# EAGLE design working (EAGLE 6.4)
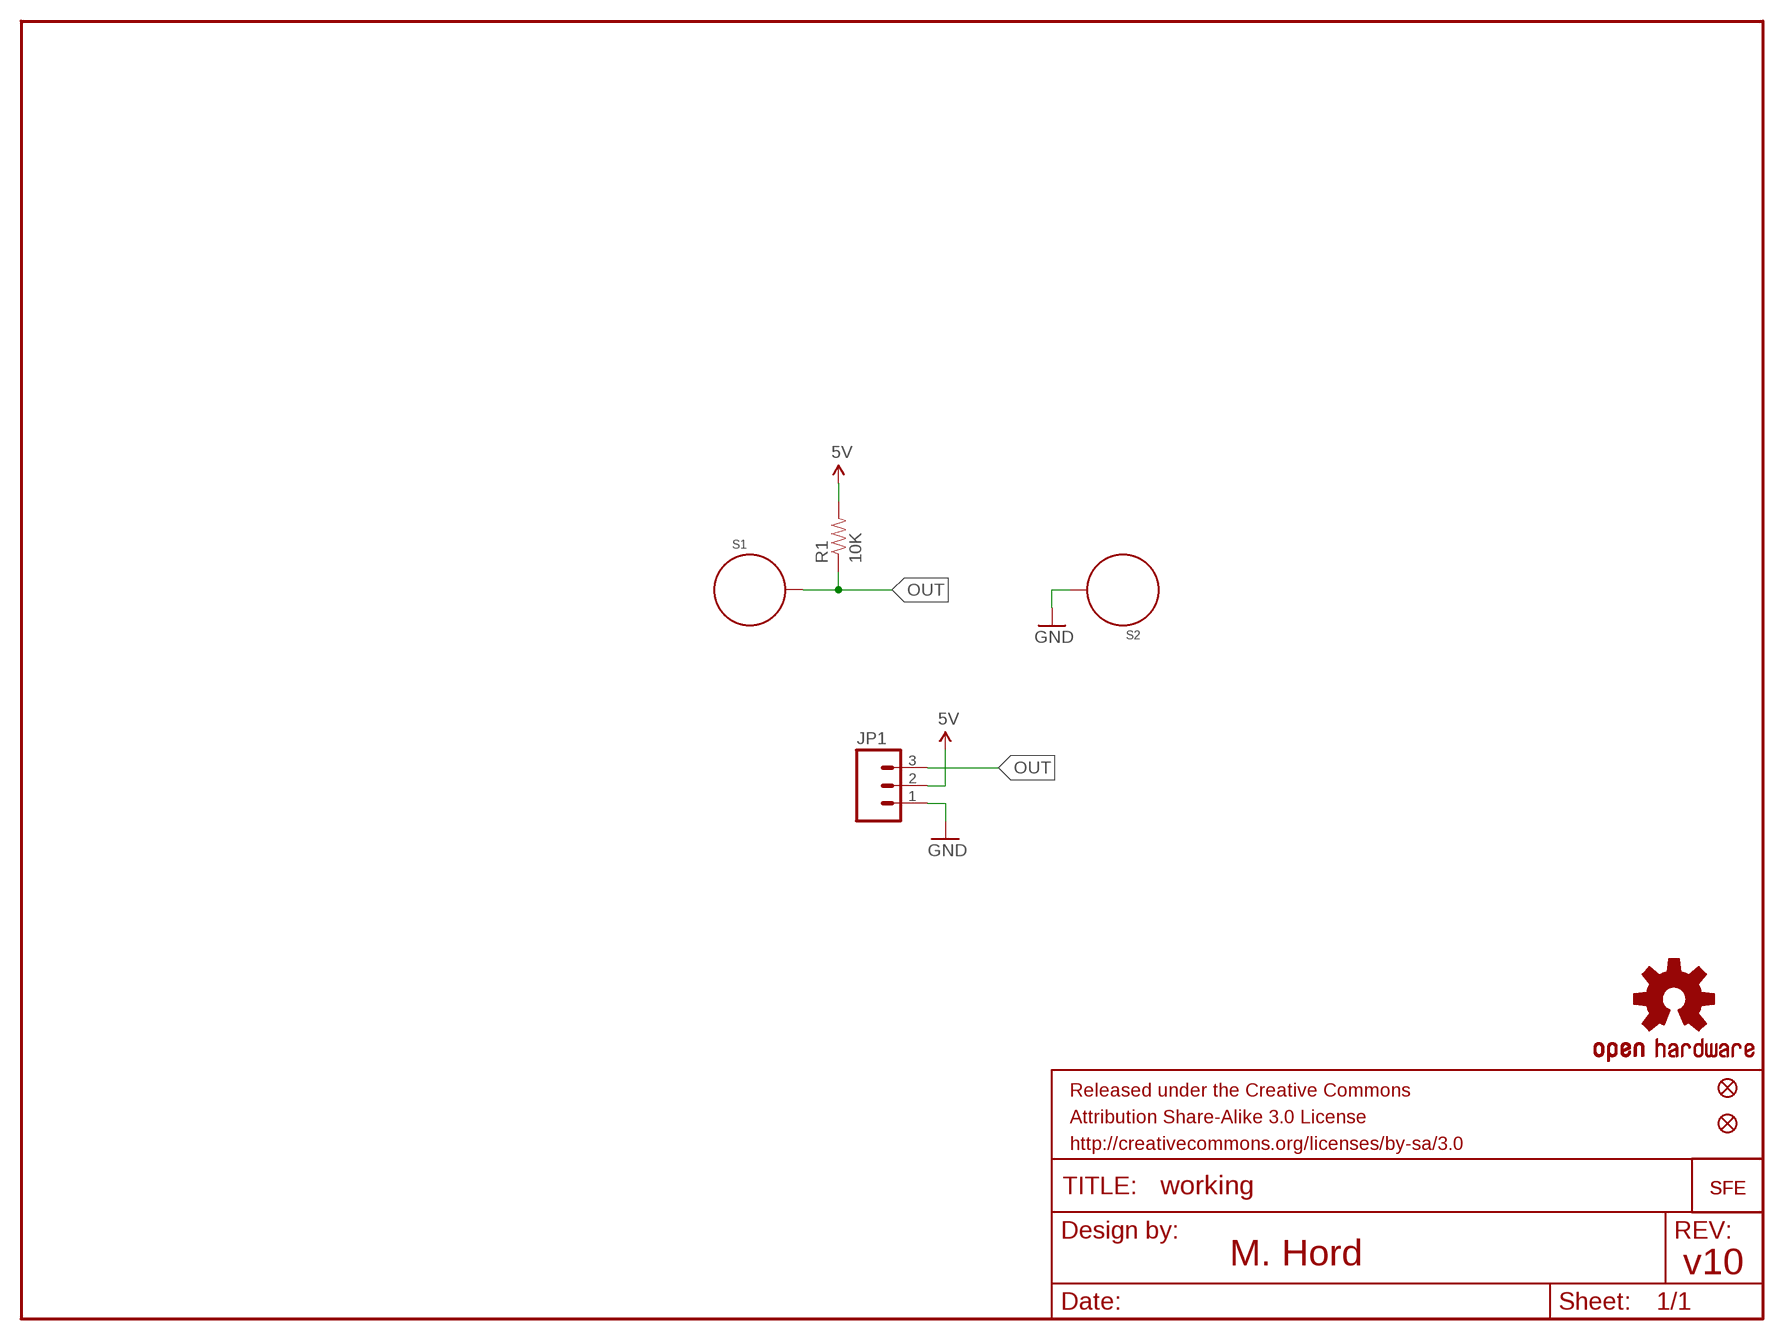
[diagram p0: schematic, sheet 1]

## Parts
FID1  FIDUCIALUFIDUCIAL  [MICRO-FIDUCIAL]
FID2  FIDUCIALUFIDUCIAL  [MICRO-FIDUCIAL]
FRAME1  FRAME-LETTER  [CREATIVE_COMMONS]
JP1  M03SMD_RA_MALE  [1X03_SMD_RA_MALE]
LOGO1  OSHW-LOGOS  [OSHW-LOGO-S]
LOGO2  LOGO-SFESK  [SFE-LOGO-FLAME]
LOGO3  OSHW-LOGOS  [OSHW-LOGO-S]
LOGO4  LOGO-SFESK  [SFE-LOGO-FLAME]
R1  10K  10KOHM1/10W1%(0603)0603  [0603-RES]
S1  STANDOFF_ELECTRICAL  [STANDOFF-ELECTRICAL]
S2  STANDOFF_ELECTRICAL  [STANDOFF-ELECTRICAL]

## Nets
5V: JP1.2 R1.2
GND: JP1.1 S2.P1
OUT: JP1.3 R1.1 S1.P1

## Notes on the sheet
- M. Hord | v10

## Library data of the parts
FID1 FID2 = SparkFun-Aesthetics:FIDUCIAL: Fiducial Alignment Points Various fiducial points for machine vision alignment.
FRAME1 = SparkFun-Aesthetics:FRAME-LETTER: Schematic Frame Standard 8.5x11 US Letter frame
JP1 = SparkFun-Connectors:M03: Header 3 Standard 3-pin 0.1" header. Use with straight break away headers (SKU : PRT-00116), right angle break away headers (PRT-00553), swiss pins (PRT-00743), machine pins (PRT-00117), and female headers (PRT-00115). Molex polarized connector foot print use with SKU : PRT-08232 with associated crimp pins and housings.; PROD_ID: CONN-10925
LOGO1 LOGO3 = SparkFun-Aesthetics:OSHW-LOGO: Open Source Hardware Logo This logo indicates the piece of hardware it is found on incorporates a OSHW license and/or adheres to the definition of open source hardware found here: http://freedomdefined.org/OSHW
LOGO2 LOGO4 = SparkFun-Aesthetics:LOGO-SFE: Spark Fun Electronics PCB Logo This is the standard Spark Fun Electronics PCB logo.
R1 = SparkFun-Resistors:10KOHM1/10W1%(0603): RES-00824; PROD_ID: RES-00824
S1 S2 = SparkFun-Electromechanical:STANDOFF_ELECTRICAL: A standoff intended to be an electrically connected point. Pad size and stop size allow for a #4 Phillips pan screw head to make a solid connection to the board.

## Board
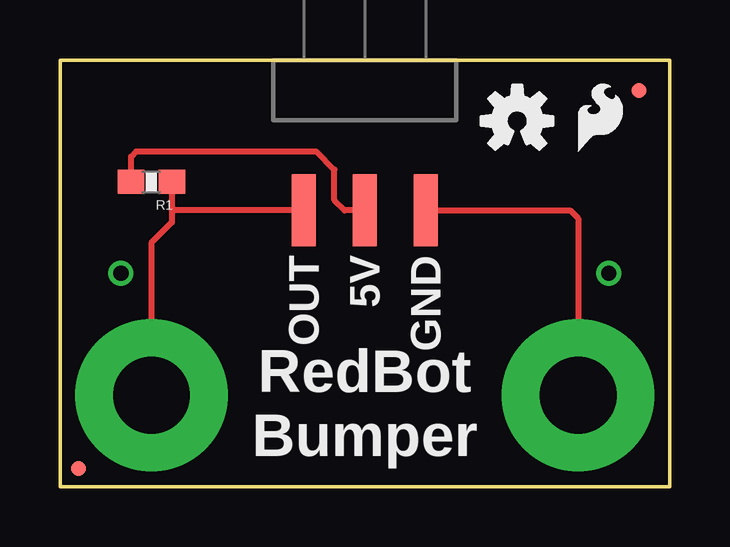
[diagram p1: board, top side]
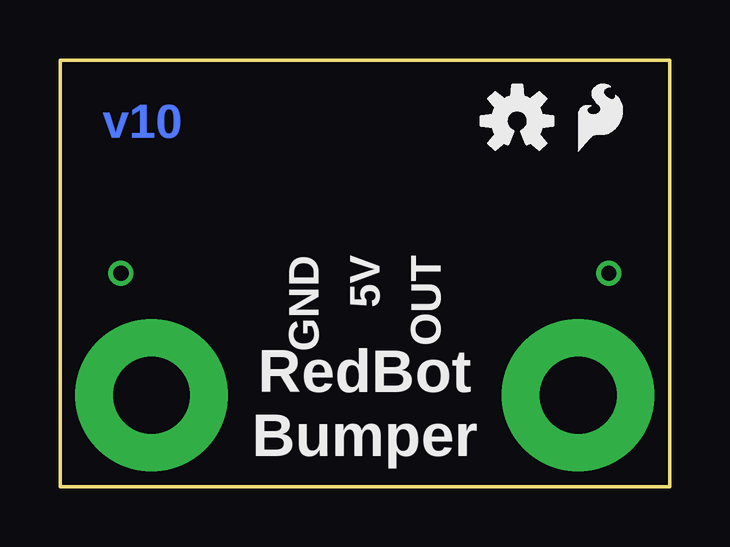
[diagram p2: board, bottom side, seen from below]

Size 25.4 x 17.78 mm. Coordinates in mm from the lower left corner, seen from the top.
Outline: 0,0 25.4,0 25.4,17.78 0,17.78 0,0
Copper layers (1*16): Top 0.035mm / dielectric 1.5mm / Bottom 0.035mm
Design rules "default": minimum track width 10mil, minimum drill 0.6mm, track to track 8mil, track to pad 8mil, pad to pad 8mil, via to via 8mil, smd to smd 8mil, copper to edge 40mil, drill to drill 8mil, minimum pad ring 10mil, minimum via ring 8mil, stop-mask expansion 4mil, vias tented up to drill 0mil, thermal gap 10mil

### Footprints (pad centres in the part's own frame; a part is rotated, then mirrored left to right if it is on the bottom)
MICRO-FIDUCIAL = smd 0.635 x 0.635: 1 0,0
1X03_SMD_RA_MALE = smd 1 x 3: 1 -2.54,5; 2 0,5; 3 2.54,5
0603-RES = smd 1.1 x 1: 1 -0.85,0; 2 0.85,0
STANDOFF-ELECTRICAL = drill 3.2 pad 6.35: P1 0,0

### Placement (x,y rotation side)
FID1  0.76,0.76 0 top
FID2  24.13,16.51 0 top
FRAME1  -77.47,15.24 0 top  (outside the outline)
JP1  12.7,16.51 180 top
LOGO1  19.05,15.24 0 top
LOGO2  21.59,13.97 0 top
LOGO3  6.35,15.24 0 bottom
LOGO4  3.81,13.97 0 bottom
R1  3.81,12.7 180 top
S1  3.81,3.81 0 top
S2  21.59,3.81 0 top

### Tracks (layer width: path | path; a pad name or v marks a point on that pad's centre or on a via)
5V
  Top 0.254: JP1.2 11.86,11.51 11.43,11.94 11.43,13.21 10.67,13.97 3.17,13.97 2.96,13.76 R1.2
GND
  Top 0.254: JP1.1 21.26,11.51 21.59,11.18 S2.P1
N$1  (via drill 0.64)
  other vias: 2.54,8.89
N$2  (via drill 0.64)
  other vias: 22.86,8.89
OUT
  Top 0.152: 4.74,11.51 4.66,11.43
  Top 0.254: R1.1 4.66,11.43 4.66,11.01 3.81,10.16 S1.P1 | JP1.3 4.74,11.51

### Text on the board
Bottom: v10
tPlace: OUT | 5V | GND | RedBot / Bumper
bPlace: OUT | 5V | GND | RedBot / Bumper